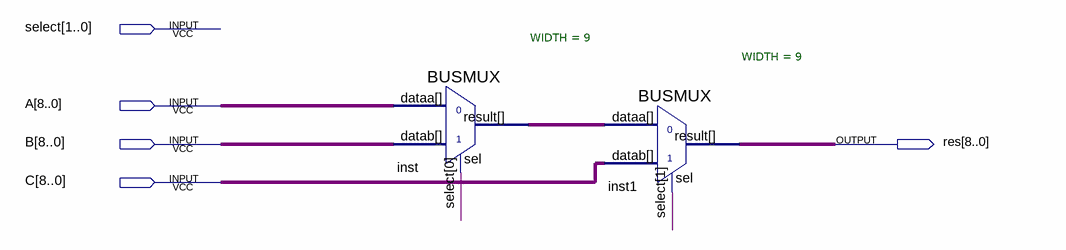
[diagram p0: schematic sheet]
// Quartus schematic mux3x.bdf as structural Verilog: 2 symbols, 5 pins
module mux3x (
  input  [1:0] select,
  input  [8:0] A,
  input  [8:0] B,
  input  [8:0] C,
  output [8:0] res
);

  wire [8:0] inst_result;

  BUSMUX #(.WIDTH(9)) inst (.datab(B), .sel(select[0]), .dataa(A), .result(inst_result));
  BUSMUX #(.WIDTH(9)) inst1 (.datab(C), .sel(select[1]), .dataa(inst_result), .result(res));
endmodule
